# EAGLE schematic dual-channel-buck-v0 (EAGLE 5.07)

## Sheet 1 of 2
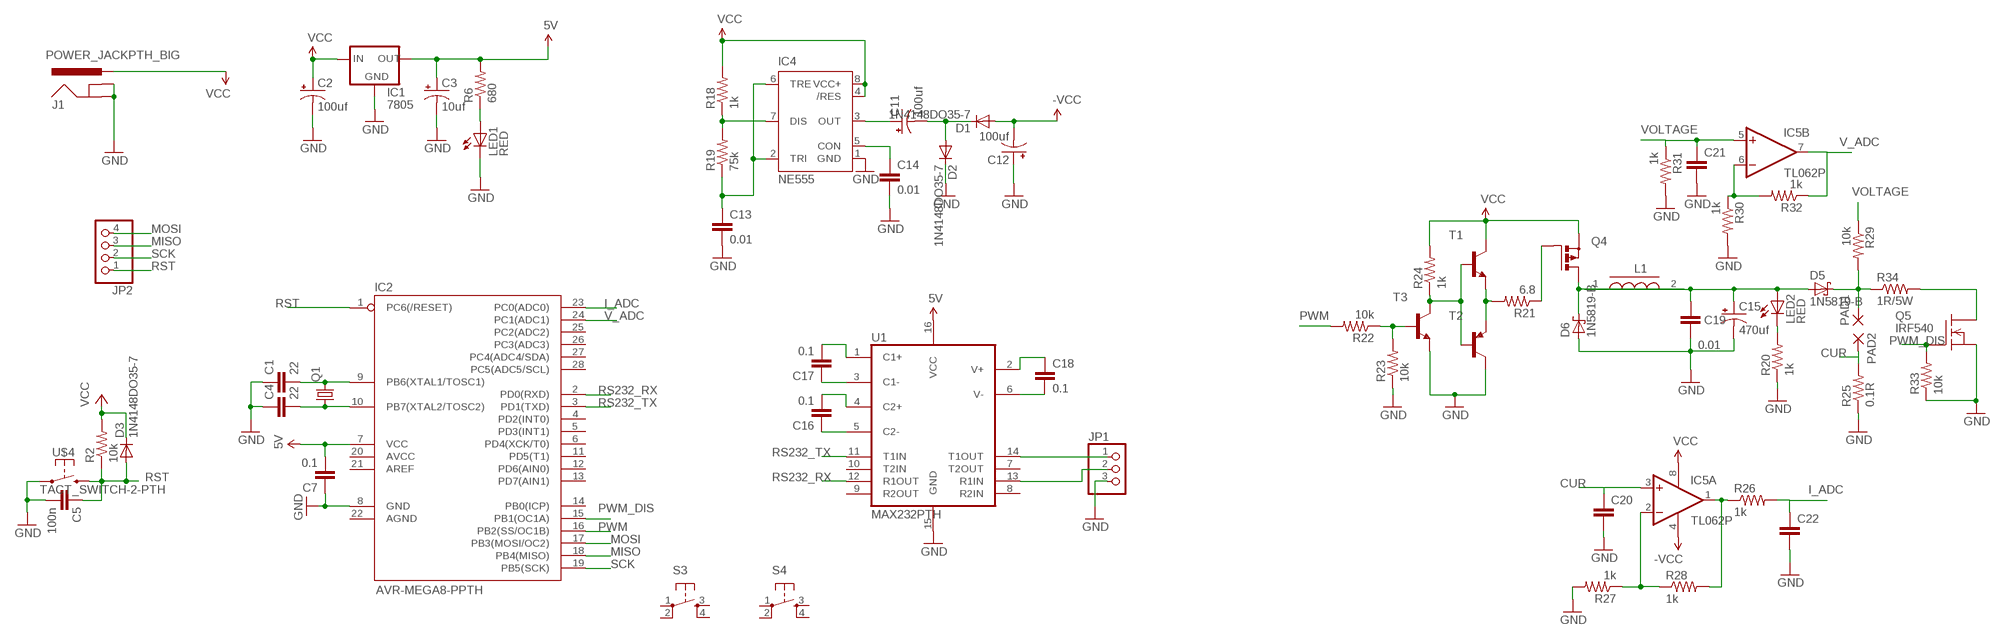
[diagram p0: schematic, sheet 1]

### Parts
C1  22  CAP0805  [0805]
C2  100uf  CAP_POLD  [PANASONIC_D]
C3  10uf  CAP_POLD  [PANASONIC_D]
C4  22  CAP0805  [0805]
C5  100n  CAP0805  [0805]
C7  0.1  CAP0805  [0805]
C11  100uf  CAP_POLD  [PANASONIC_D]
C12  100uf  CAP_POLD  [PANASONIC_D]
C13  0.01  CAP0805  [0805]
C14  0.01  CAP0805  [0805]
C15  470uf  CAP_POLPTH1  [CPOL-RADIAL-100UF-25V]
C16  0.1  CAP0805  [0805]
C17  0.1  CAP0805  [0805]
C18  0.1  CAP0805  [0805]
C19  0.01  CAP0805  [0805]
C20  CAP0805  [0805]
C21  CAP0805  [0805]
C22  CAP0805  [0805]
D1  1N4148DO35-7  [DO35-7]
D2  1N4148DO35-7  [DO35-7]
D3  1N4148DO35-7  DIODE1N4148  [DIODE-1N4148]
D5  1N5819-B  [DO41-7.6]
D6  1N5819-B  [DO41-7.6]
IC1  7805  V_REG_78XXSIDE  [78XXL]
IC2  AVR-MEGA8-PPTH  [DIL28-3]
IC4  NE555  [DIL-08]
IC5  TL062P  [DIL08]
J1  POWER_JACKPTH_BIG  [POWER_JACK_2.1X5.5_BIG_PTH]
JP1  PINHD-1X3  [1X03]
JP2  PINHD-1X4  [1X04]
L1  INDUCTOR-IED16  [ED16]
LED1  RED  LED0805  [CHIPLED_0805]
LED2  RED  LED0805  [CHIPLED_0805]
PAD1  2,54/1,1  [2,54/1,1]
PAD2  2,54/1,1  [2,54/1,1]
Q1  CRYSTALHC49US  [HC49US]
Q4  PMOSFET_PTO220BH  [TO220BH]
Q5  IRF540  [TO220]
R2  10k  RESISTOR0805  [0805]
R6  680  RESISTOR  [0805]
R18  1k  RESISTOR  [0805]
R19  75k  RESISTOR  [0805]
R20  1k  RESISTOR  [0805]
R21  6.8  RESISTOR  [0805]
R22  10k  RESISTORPTH1  [AXIAL-0.3]
R23  10k  RESISTORPTH1  [AXIAL-0.3]
R24  1k  RESISTOR  [0805]
R25  0.1R  R-US_0414/15  [0414/15]
R26  1k  RESISTORPTH1  [AXIAL-0.3]
R27  1k  RESISTOR  [0805]
R28  1k  RESISTOR  [0805]
R29  10k  RESISTOR  [0805]
R30  1k  RESISTOR  [0805]
R31  1k  RESISTOR  [0805]
R32  1k  RESISTOR  [0805]
R33  10k  RESISTOR  [0805]
R34  1R/5W  R-US_0414/15  [0414/15]
S3  TAC_SWITCHPTH  [TACTILE-PTH]
S4  TAC_SWITCHPTH  [TACTILE-PTH]
T1  -NPN-SOT23-EBC  [SOT23-EBC]
T2  -PNP-SOT23-EBC  [SOT23-EBC]
T3  -NPN-SOT23-EBC  [SOT23-EBC]
U1  MAX232PTH  [DIL16]
U$4  TACT_SWITCH-2-PTH  [ALPS-SKHV]

### Nets
5V: C3.+ C7.2 IC1.OUT IC2.7(VCC) R6.2 U1.16(VCC)
-VCC: C12.- D1.A IC5.4(P:V-)
CUR: C20.1 IC5.3(A:+IN) PAD2.1(P) R25.2
GND: C1.1 C2.- C3.- C4.1 C5.2 C7.1 C12.+ C13.2 C14.2 C15.2(-) C19.2 C20.2 C21.2 C22.2 D2.C D6.A IC1.GND IC2.8(GND) IC4.1(GND) J1.GND J1.GNDBREAK JP1.3 LED1.C Q5.3(S) R20.1 R23.P$1 R25.1 R27.2 R30.2 R31.2 R33.1 T2.C T3.E U1.15(GND) U$4.2
I_ADC: C22.1 IC2.23(PC0(ADC0)) R26.P$2
MISO: IC2.18(PB4(MISO)) JP2.3
MOSI: IC2.17(PB3(MOSI/OC2)) JP2.4
N$2: C1.2 IC2.9(PB6(XTAL1/TOSC1)) Q1.2
N$3: C4.2 IC2.10(PB7(XTAL2/TOSC2)) Q1.1
N$10: LED1.A R6.1
N$11: IC4.7(DIS) R18.1 R19.2
N$12: C13.1 IC4.2(TRI) IC4.6(TRE) R19.1
N$13: R22.P$1 R23.P$2 T3.B
N$14: C14.1 IC4.5(CON)
N$19: C11.+ IC4.3(OUT)
N$23: C11.- D1.C D2.A
N$24: C17.2 U1.1(C1+)
N$25: C17.1 U1.3(C1-)
N$26: R24.1 T1.B T2.B T3.C
N$27: R21.2 T1.E T2.E
N$28: C16.2 U1.4(C2+)
N$29: C16.1 U1.5(C2-)
N$30: C18.1 U1.2(V+)
N$31: C18.2 U1.6(V-)
N$32: JP1.1 U1.14(T1OUT)
N$33: JP1.2 U1.13(R1IN)
N$34: LED2.C R20.2
N$35: Q4.G R21.1
N$36: C15.1(+) C19.1 D5.A L1.1 LED2.A
N$37: D6.C L1.2 Q4.D
N$38: D5.C PAD1.1(P) R29.2 R34.1
N$39: IC5.2(A:-IN) R27.1 R28.1
N$40: IC5.1(A:OUT) R26.P$1 R28.2
N$41: IC5.6(B:-IN) R30.1 R32.2
N$42: Q5.2(D) R34.2
PWM: IC2.16(PB2(SS/OC1B)) R22.P$2
PWM_DIS: IC2.15(PB1(OC1A)) Q5.1(G) R33.2
RS232_RX: IC2.2(PD0(RXD)) U1.12(R1OUT)
RS232_TX: IC2.3(PD1(TXD)) U1.11(T1IN)
RST: C5.1 D3.A IC2.1(PC6(/RESET)) JP2.1 R2.1 U$4.3
SCK: IC2.19(PB5(SCK)) JP2.2
V_ADC: IC2.24(PC1(ADC1)) IC5.7(B:OUT) R32.1
VCC: C2.+ D3.C IC1.IN IC4.4(/RES) IC4.8(VCC+) IC5.8(P:V+) J1.PWR Q4.S R2.2 R18.2 R24.2 T1.C
VOLTAGE: C21.1 IC5.5(B:+IN) R29.1 R31.1
Unconnected: IC2.4(PD2(INT0)) IC2.5(PD3(INT1)) IC2.6(PD4(XCK/T0)) IC2.11(PD5(T1)) IC2.12(PD6(AIN0)) IC2.13(PD7(AIN1)) IC2.14(PB0(ICP)) IC2.20(AVCC) IC2.21(AREF) IC2.22(AGND) IC2.25(PC2(ADC2)) IC2.26(PC3(ADC3)) IC2.27(PC4(ADC4/SDA)) IC2.28(PC5(ADC5/SCL)) S3.1 S3.2 S3.3 S3.4 S4.1 S4.2 S4.3 S4.4 U1.7(T2OUT) U1.8(R2IN) U1.9(R2OUT) U1.10(T2IN)

## Sheet 2 of 2

## Library data of the parts
C1 C4 C7 C13 C14 C16-C22 = SparkFun:CAP: Capacitor Standard 0603 ceramic capacitor, and 0.1" leaded capacitor.
C2 C11 C12 C15 = SparkFun:CAP_POL: Capacitor Polarized
C3 = digital-toy:CAP_POL: Capacitor Polarized
C5 = digital-toy:CAP: Capacitor Standard 0603 ceramic capacitor, and 0.1" leaded capacitor.
D1 D2 = diode:1N4148: DIODE high speed (Philips)
D3 = digital-toy:DIODE: Diode These are standard reverse protection diodes and small signal diodes. SMA package can handle up to about 1A. SOD-323 can handle about 200mA. What the SOD-323 package when ordering, there are some mfgs out there that are 5-pin packages.
D5 D6 = diode:1N581*: 1.0A SCHOTTKY BARRIER RECTIFIER Source: http://www.diodes.com/datasheets/ds23001.pdf
IC1 = SparkFun:V_REG_78XX: Voltage Regulator Standard 7805 5V regulator. IGO (Input Ground Output). Spark Fun Electronics SKU : COM-00107
IC2 = SparkFun:AVR-MEGA8-P: MICROCONTROLLER 8 Kbytes FLASH 1 kbytes SRAM 512 bytes EEPROM USART 4-channel 10 bit ADC 2-channel 8 bit ADC
IC4 = st-microelectronics:NE555: General purpose bipolar Timer
IC5 = linear:TL062: OP AMP
J1 = digital-toy:POWER_JACK: Power Jack This is the standard 5.5mm barrel jack for power. The PTH is the most common, proven, reliable, footprint. All others are experimental. The Slot footprint only works if the mill layer is transmitted to the PCB fab house so be warned. Spark Fun Electronics SKU : PRT-00119. Mating wall wart : TOL-00298 (and others)
JP1 = pinhead:PINHD-1X3: PIN HEADER
JP2 = pinhead:PINHD-1X4: PIN HEADER
L1 = digital-toy:INDUCTOR-I: Inductors with Iron
LED1 LED2 = digital-toy:LED: LEDs Standard schematic elements and footprints for 5mm, 3mm, 1206, and 0603 sized LEDs. 5mm - Spark Fun Electronics SKU : COM-00529 (and others) copy led.lbr 0805 led here, by hyl digital-toy. 2010.6.29
PAD1 PAD2 = wirepad:2,54/1,1: THROUGH-HOLE PAD
Q1 = SparkFun:CRYSTAL: Crystals Various standard crystals. Proven footprints. Spark Fun Electronics SKU : COM-00534
Q4 = transistor-power:PMOSFET_P: Power MOSFET P-Channel
Q5 = transistor-fet:IRF540: N-Channel Enhancement MOSFET (HEXFET); 100V; 28A; 0,077Ohm
R2 = digital-toy:RESISTOR: Resistor
R6 R18-R24 R26-R33 = SparkFun:RESISTOR: Resistor
R25 R34 = rcl:R-US_: RESISTOR, American symbol
S3 S4 = SparkFun:TAC_SWITCH: Momentary Switch Button commonly used for reset or general input. Spark Fun Electronics SKU : COM-00097
T1 T3 = digital-toy:*-NPN-: NPN Transistror
T2 = digital-toy:*-PNP-: PNP Transistror
U1 = SparkFun:MAX232: RS232 Transceiver Very common IC. This is generically called 'MAX232', but works with the 3V equivalent MAX3232 generic ICs. Field tested and mother approved. Spark Fun Electronics SKU : COM-00316 (DIP) and COM-00589 (SMD)
U$4 = digital-toy:TACT_SWITCH-2